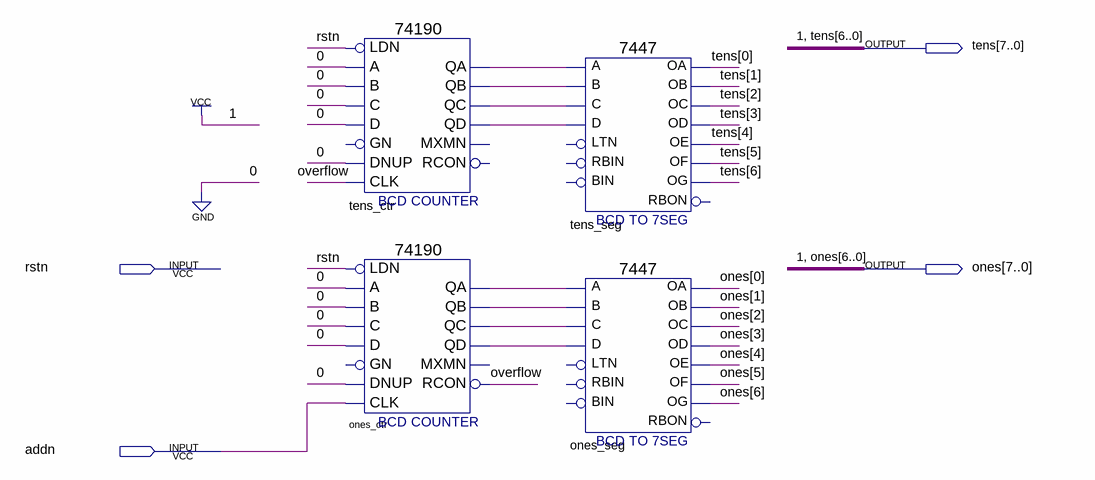
[diagram p0: schematic sheet]
// Quartus schematic Turns.bdf as structural Verilog: 4 symbols, 4 pins
module Turns (
  input  rstn,
  input  addn,
  output [7:0] tens,
  output [7:0] ones
);

  wire ones_ctr_qa, ones_ctr_qb, ones_ctr_qc, ones_ctr_qd, overflow, tens_ctr_qa, tens_ctr_qb, tens_ctr_qc,
       tens_ctr_qd;

  \74190  tens_ctr (
    .LDN(rstn), .A(1'b0), .C(1'b0), .B(1'b0), .D(1'b0), .CLK(overflow), .DNUP(1'b0), .QA(tens_ctr_qa),
    .QB(tens_ctr_qb), .QD(tens_ctr_qd), .QC(tens_ctr_qc));  // open: GN, MXMN, RCON
  \74190  ones_ctr (
    .LDN(rstn), .A(1'b0), .C(1'b0), .B(1'b0), .D(1'b0), .CLK(addn), .DNUP(1'b0), .QA(ones_ctr_qa),
    .QB(ones_ctr_qb), .QD(ones_ctr_qd), .QC(ones_ctr_qc), .RCON(overflow));  // open: GN, MXMN
  \7447  tens_seg (
    .B(tens_ctr_qb), .C(tens_ctr_qc), .D(tens_ctr_qd), .A(tens_ctr_qa), .OB(tens[1]), .OC(tens[2]),
    .OE(tens[4]), .OD(tens[3]), .OF(tens[5]), .OG(tens[6]), .OA(tens[0]));  // open: LTN, RBIN, BIN, RBON
  \7447  ones_seg (
    .B(ones_ctr_qb), .C(ones_ctr_qc), .D(ones_ctr_qd), .A(ones_ctr_qa), .OB(ones[1]), .OC(ones[2]),
    .OE(ones[4]), .OD(ones[3]), .OF(ones[5]), .OG(ones[6]), .OA(ones[0]));  // open: LTN, RBIN, BIN, RBON

  assign ones[7] = 1'b1;
  assign tens[7] = 1'b1;
endmodule
